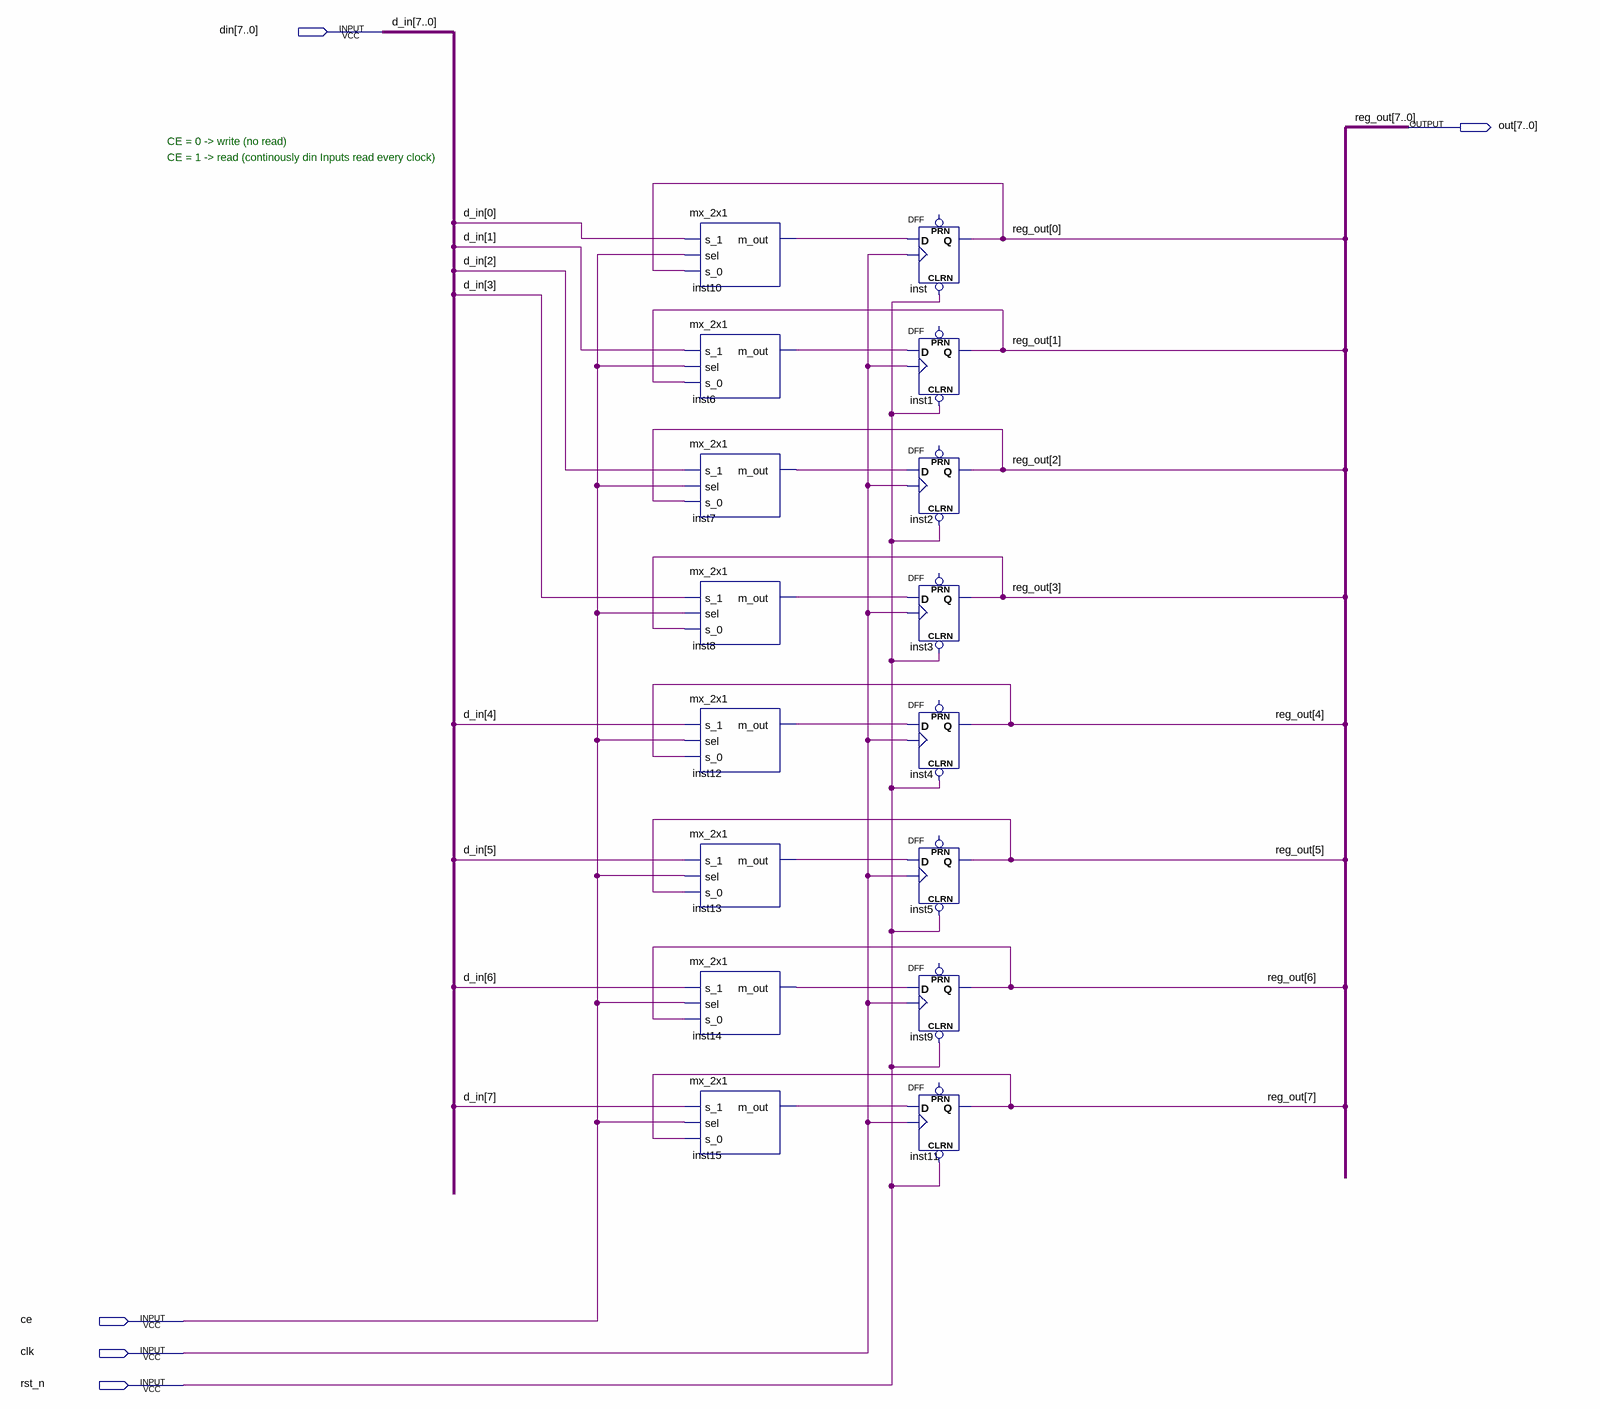
[diagram p0: schematic sheet]
// Quartus schematic reg_8bit_ce.bdf as structural Verilog: 16 symbols, 5 pins
module reg_8bit_ce (
  input  [7:0] din,
  input  ce,
  input  clk,
  input  rst_n,
  output [7:0] out
);

  wire inst6_m_out, inst7_m_out, inst8_m_out, inst10_m_out, inst12_m_out, inst13_m_out, inst14_m_out,
       inst15_m_out;

  mx_2x1 inst10 (.s_1(din[0]), .sel(ce), .s_0(out[0]), .m_out(inst10_m_out));
  mx_2x1 inst6 (.s_1(din[1]), .sel(ce), .s_0(out[1]), .m_out(inst6_m_out));
  mx_2x1 inst7 (.s_1(din[2]), .sel(ce), .s_0(out[2]), .m_out(inst7_m_out));
  mx_2x1 inst8 (.s_1(din[3]), .sel(ce), .s_0(out[3]), .m_out(inst8_m_out));
  mx_2x1 inst12 (.s_1(din[4]), .sel(ce), .s_0(out[4]), .m_out(inst12_m_out));
  mx_2x1 inst13 (.s_1(din[5]), .sel(ce), .s_0(out[5]), .m_out(inst13_m_out));
  mx_2x1 inst14 (.s_1(din[6]), .sel(ce), .s_0(out[6]), .m_out(inst14_m_out));
  mx_2x1 inst15 (.s_1(din[7]), .sel(ce), .s_0(out[7]), .m_out(inst15_m_out));
  DFF inst (.CLRN(rst_n), .CLK(clk), .D(inst10_m_out), .Q(out[0]));  // open: PRN
  DFF inst1 (.CLRN(rst_n), .CLK(clk), .D(inst6_m_out), .Q(out[1]));  // open: PRN
  DFF inst2 (.CLRN(rst_n), .CLK(clk), .D(inst7_m_out), .Q(out[2]));  // open: PRN
  DFF inst3 (.CLRN(rst_n), .CLK(clk), .D(inst8_m_out), .Q(out[3]));  // open: PRN
  DFF inst4 (.CLRN(rst_n), .CLK(clk), .D(inst12_m_out), .Q(out[4]));  // open: PRN
  DFF inst5 (.CLRN(rst_n), .CLK(clk), .D(inst13_m_out), .Q(out[5]));  // open: PRN
  DFF inst9 (.CLRN(rst_n), .CLK(clk), .D(inst14_m_out), .Q(out[6]));  // open: PRN
  DFF inst11 (.CLRN(rst_n), .CLK(clk), .D(inst15_m_out), .Q(out[7]));  // open: PRN

  // Other names for the same wires on the sheet: d_in[7:0] = din; reg_out[7:0] = out

  // Notes on the sheet:
  //   CE = 0 -> write (no read)
  //   CE = 1 -> read (continously din Inputs read every clock)
endmodule
